# EAGLE design power_switch_1 (EAGLE 6.4)
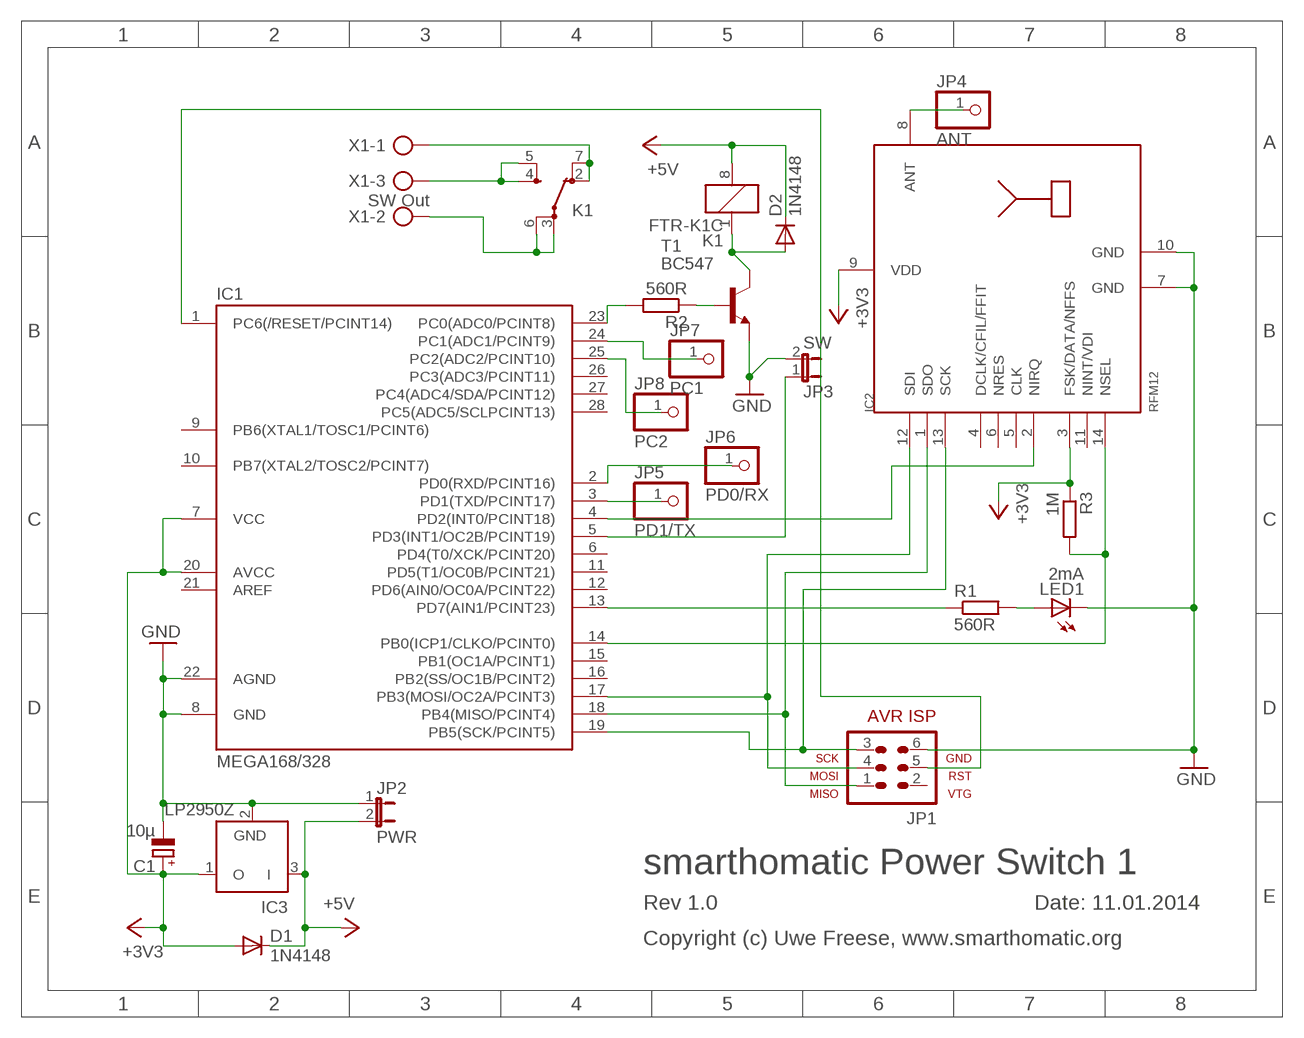
[diagram p0: schematic, sheet 1]

## Parts
C1  10µ  CPOL-EUE1.8-4  [E1,8-4]
D1  1N4148  1N4148DO35-7  [DO35-7]
D2  1N4148  1N4148DO35-7  [DO35-7]
IC1  MEGA168/328  MEGA48/88/168-PU  [DIL28-3]
IC2  RFM12  [RFM]
IC3  LP2950Z  [TO92]
JP1  AVR-ISP-6  [AVR-ISP-6]
JP2  PWR  JP1E  [JP1]
JP3  SW  JP1E  [JP1]
JP4  ANT  PINHD-1X1  [1X01]
JP5  PD1/TX  PINHD-1X1  [1X01]
JP6  PD0/RX  PINHD-1X1  [1X01]
JP7  PC1  PINHD-1X1  [1X01]
JP8  PC2  PINHD-1X1  [1X01]
K1  FTR-K1C  [FTR-K1C]
LED1  2mA  LED3MM  [LED3MM]
R1  560R  R-EU_0207/7  [0207/7]
R2  560R  R-EU_0207/7  [0207/7]
R3  1M  R-EU_0207/7  [0207/7]
T1  BC547  [TO92]
X1  SW Out  AK500/3  [AK500/3]

## Nets
+3V3: C1.+ D1.A IC1.7(VCC) IC1.20(AVCC) IC2.3(FSK/DATA/NFFS) IC2.9(VDD) IC3.1(O) R3.1
+5V: D1.C D2.C IC3.3(I) JP2.2 K1.8
GND: C1.- IC1.8(GND) IC1.22(AGND) IC2.7(GND) IC2.10(GND) IC3.2(GND) JP1.6 JP2.1 JP3.2 LED1.K(C) T1.1(E)
N$1: IC1.23(PC0(ADC0/PCINT8)) R2.2
N$3: IC1.17(PB3(MOSI/OC2A/PCINT3)) IC2.12(SDI) JP1.4
N$4: IC1.18(PB4(MISO/PCINT4)) IC2.1(SDO) JP1.1
N$5: IC1.19(PB5(SCK/PCINT5)) IC2.13(SCK) JP1.3
N$6: IC1.13(PD7(AIN1/PCINT23)) R1.1
N$7: R2.1 T1.2(B)
N$8: IC1.1(PC6(/RESET/PCINT14)) JP1.5
N$9: D2.A K1.1 T1.3(C)
N$10: IC1.5(PD3(INT1/OC2B/PCINT19)) JP3.1
N$11: IC2.8(ANT) JP4.1
N$12: LED1.A R1.2
N$13: IC1.14(PB0(ICP1/CLKO/PCINT0)) IC2.14(NSEL) R3.2
N$14: K1.2(-1:OA) K1.7(-1:OB) X1.1
N$15: IC1.4(PD2(INT0/PCINT18)) IC2.2(NIRQ)
N$16: IC1.24(PC1(ADC1/PCINT9)) JP7.1
N$17: IC1.25(PC2(ADC2/PCINT10)) JP8.1
N$18: K1.4(-1:SA) K1.5(-1:SB) X1.3
N$19: IC1.2(PD0(RXD/PCINT16)) JP6.1
N$20: IC1.3(PD1(TXD/PCINT17)) JP5.1
N$21: K1.3(-1:PA) K1.6(-1:PB) X1.2
Unconnected: IC1.6(PD4(T0/XCK/PCINT20)) IC1.9(PB6(XTAL1/TOSC1/PCINT6)) IC1.10(PB7(XTAL2/TOSC2/PCINT7)) IC1.11(PD5(T1/OC0B/PCINT21)) IC1.12(PD6(AIN0/OC0A/PCINT22)) IC1.15(PB1(OC1A/PCINT1)) IC1.16(PB2(SS/OC1B/PCINT2)) IC1.21(AREF) IC1.26(PC3(ADC3/PCINT11)) IC1.27(PC4(ADC4/SDA/PCINT12)) IC1.28(PC5(ADC5/SCLPCINT13)) IC2.4(DCLK/CFIL/FFIT) IC2.5(CLK) IC2.6(NRES) IC2.11(NINT/VDI) JP1.2

## Notes on the sheet
- smarthomatic Power Switch 1
- Rev 1.0 | Date: 11.01.2014
- Copyright (c) Uwe Freese, www.smarthomatic.org

## Library data of the parts
C1 = rcl:CPOL-EU: POLARIZED CAPACITOR, European symbol
D1 D2 = diode:1N4148: DIODE high speed (Philips)
IC1 = avr-5-4.16:MEGA48/88/168-PU
IC2 = hopeRF:RFM12
IC3 = linear:LP2950: 100 mA, Low Power Low Dropout Voltage Regulator Source: http://www.onsemi.com/pub/Collateral/LP2950-D.PDF
JP1 = avr-5-4.16:AVR-ISP-6: AVR ISP-6 Serial Programming Header
JP2 JP3 = jumper:JP1E: JUMPER
JP4-JP8 = pinhead:PINHD-1X1: PIN HEADER
K1 = relay:FTR-K1C: NETZRELAIS FTR-K1CK024W1XUM 16A/250VAC 1 Umschaltkontakt Distributor: Conrad Electronic Bestell Nr.: 504389-13 - 24V Source: http://www.produktinfo.conrad.com/datenblaetter/500000-524999/504384-da-01-de-NETZRELAIS_FTR_K1CK012W1XUM_16A_250VAC.pdf; OC_FARNELL: unknown; OC_NEWARK: unknown
LED1 = led:LED: LED OSRAM: - CHIPLED LG R971, LG N971, LY N971, LG Q971, LY Q971, LO R971, LY R971 LH N974, LH R974 LS Q976, LO Q976, LY Q976 LO Q996 - Hyper CHIPLED LW Q18S LB Q993, LB Q99A, LB R99A - SideLED LS A670, LO A670, LY A670, LG A670, LP A670 LB A673, LV A673, LT A673, LW A673 LH A674 LY A675 LS A676, LA A676, LO A676, LY A676, LW A676 LS A679, LY A679, LG A679 - Hyper Micro SIDELED® LS Y876, LA Y876, LO Y876, LY Y876 LT Y87S - SmartLED LW L88C, LW L88S LB L89C, LB L89S, LG L890 LS L89K, LO L89K, LY L89K LS L896, LA L896, LO L896, LY L896 - TOPLED LS T670, LO T670, LY T670, LG T670, LP T670 LSG T670, LSP T670, LSY T670, LOP T670, LYG T670 LG T671, LOG T671, LSG T671 LB T673, LV T673, LT T673, LW T673 LH T674 LS T676, LA T676, LO T676, LY T676, LB T676, LH T676, LSB T676, LW T676 LB T67C, LV T67C, LT T67C, LS T67K, LO T67K, LY T67K, LW E67C LS E67B, LA E67B, LO E67B, LY E67B, LB E67C, LV E67C, LT E67C LW T67C LS T679, LY T679, LG T679 LS T770, LO T770, LY T770, LG T770, LP T770 LB T773, LV T773, LT T773, LW T773 LH T774 LS E675, LA E675, LY E675, LS T675 LS T776, LA T776, LO T776, LY T776, LB T776 LHGB T686 LT T68C, LB T68C - Hyper Mini TOPLED® LB M676 - Mini TOPLED Santana® LG M470 LS M47K, LO M47K, LY M47K Source: http://www.osram.convergy.de LUXEON: - LUMILED® LXK2-PW12-R00, LXK2-PW12-S00, LXK2-PW14-U00, LXK2-PW14-V00 LXK2-PM12-R00, LXK2-PM12-S00, LXK2-PM14-U00 LXK2-PE12-Q00, LXK2-PE12-R00, LXK2-PE12-S00, LXK2-PE14-T00, LXK2-PE14-U00 LXK2-PB12-K00, LXK2-PB12-L00, LXK2-PB12-M00, LXK2-PB14-N00, LXK2-PB14-P00, LXK2-PB14-Q00 LXK2-PR12-L00, LXK2-PR12-M00, LXK2-PR14-Q00, LXK2-PR14-R00 LXK2-PD12-Q00, LXK2-PD12-R00, LXK2-PD12-S00 LXK2-PH12-R00, LXK2-PH12-S00 LXK2-PL12-P00, LXK2-PL12-Q00, LXK2-PL12-R00 Source: www.luxeon.com KINGBRIGHT: KA-3528ASYC Source: www.kingbright.com
R1-R3 = rcl:R-EU_: RESISTOR, European symbol
T1 = transistor:BC547: NPN TRANSISTOR
X1 = con-ptr500:AK500/3: CONNECTOR; OC_FARNELL: unknown; OC_NEWARK: unknown

## Net classes
0 default: clearance 0.305 mm

## Board
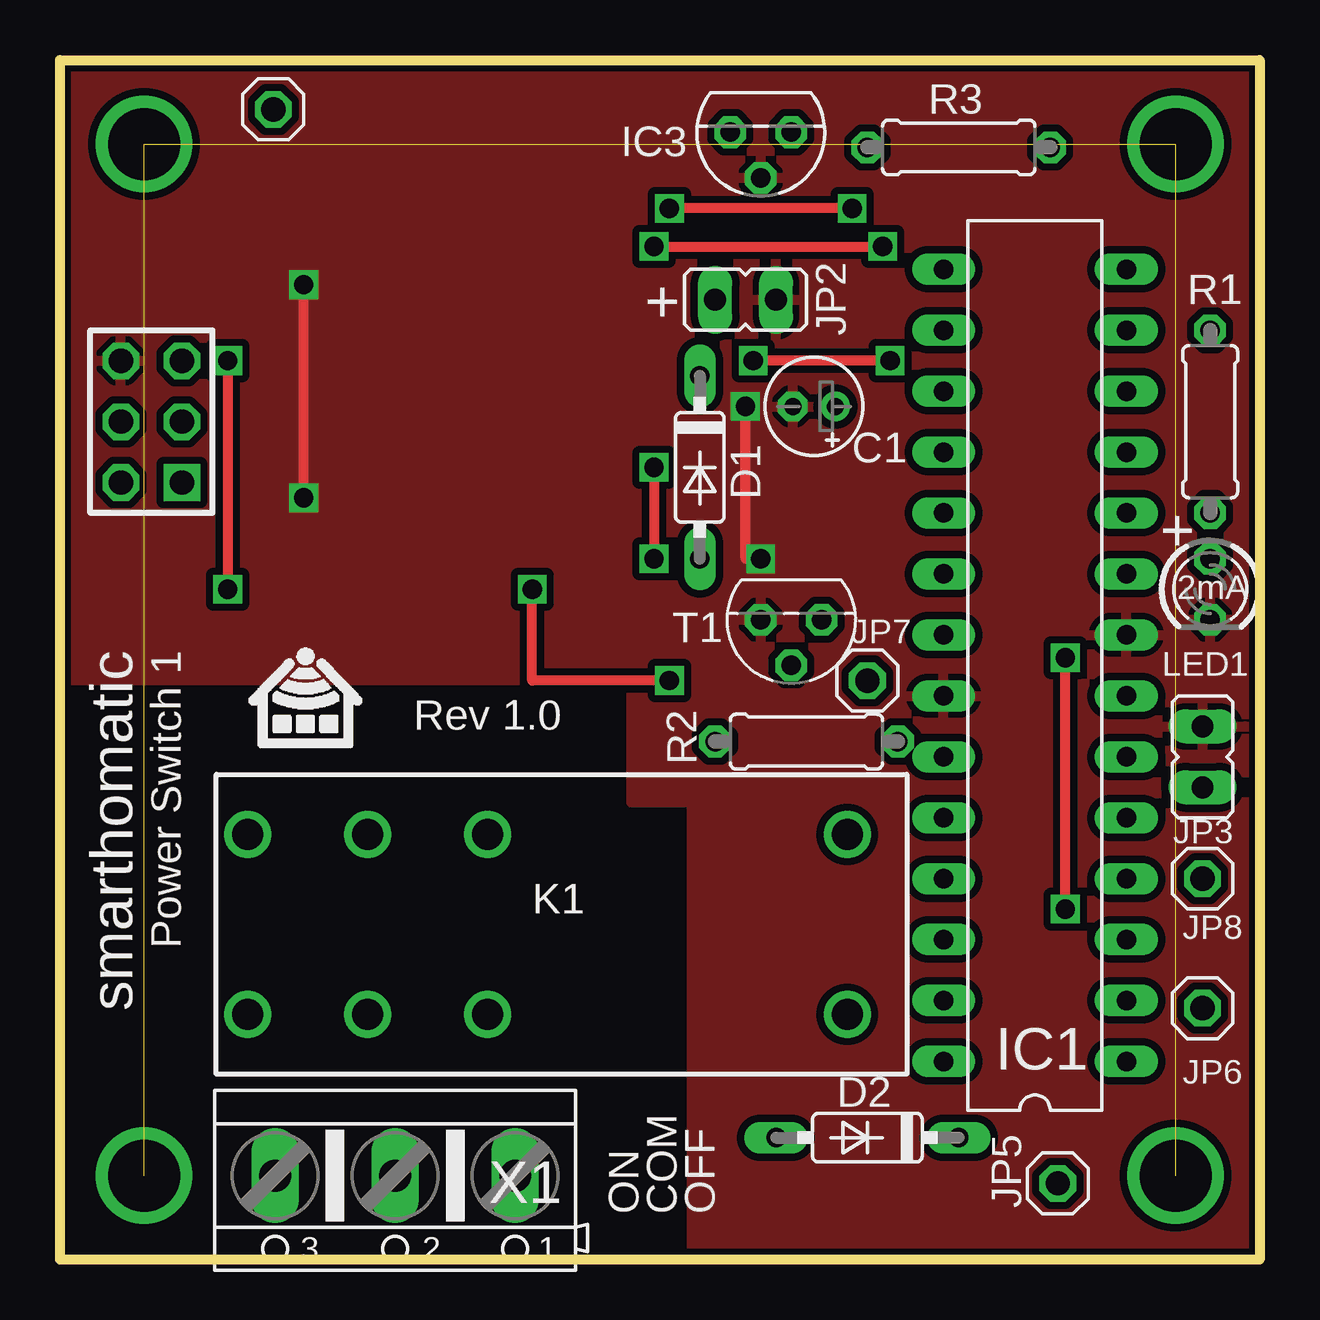
[diagram p1: board, top side]
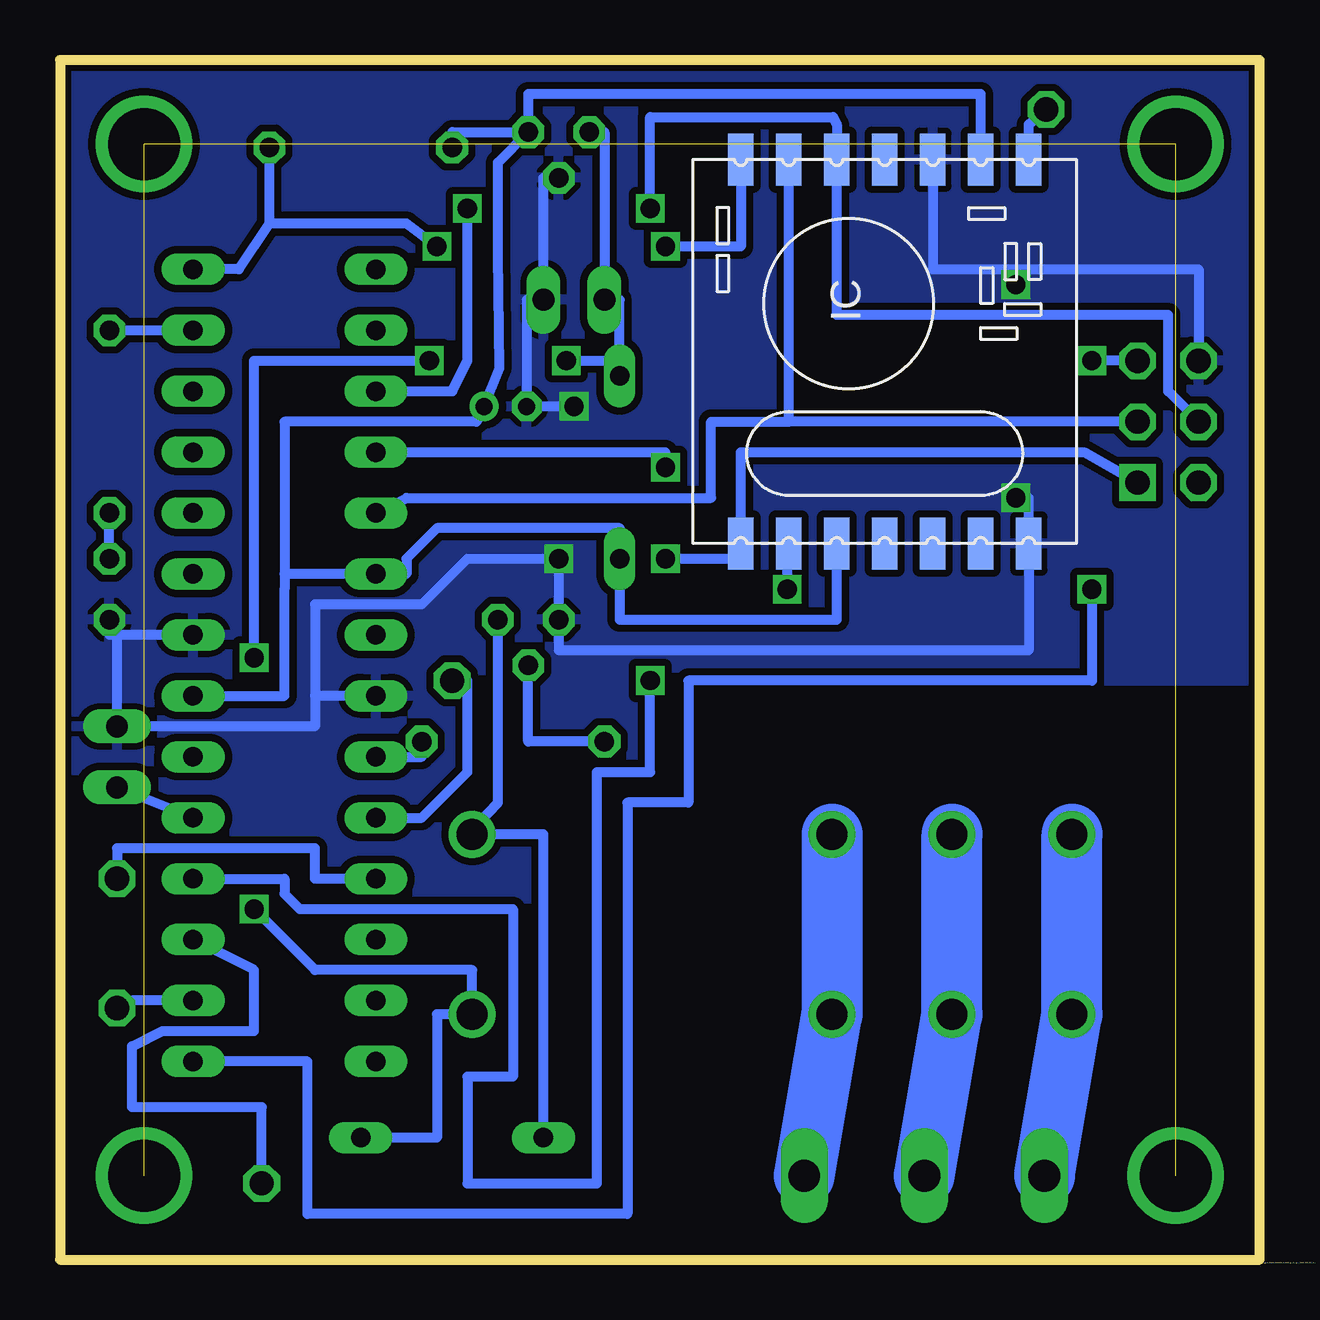
[diagram p2: board, bottom side, seen from below]

Size 50 x 50 mm. Coordinates in mm from the lower left corner, seen from the top.
Outline: 0,0 0,50 50,50 50,0 0,0
Copper layers (1*16): Top 0.035mm / dielectric 1.5mm / Bottom 0.035mm
Design rules "Fusion_eagle_rule_v1.1": minimum track width 6mil, minimum drill 12mil, track to track 6mil, track to pad 6mil, pad to pad 6mil, via to via 6mil, smd to smd 0mil, copper to edge 10mil, drill to drill 10mil, minimum pad ring 10mil, minimum via ring 6mil, stop-mask expansion 2mil, vias tented up to drill 100mil, thermal gap 10mil

### Footprints (pad centres in the part's own frame; a part is rotated, then mirrored left to right if it is on the bottom)
E1,8-4 = drill 0.711 pad 1.168: + -0.889,0 | drill 0.711 pad 1.168 octagon: - 0.889,0
DO35-7 = drill 0.813 long: A 3.81,0; C -3.81,0
DIL28-3 = drill 0.813 long: 1 -16.51,-3.81; 2 -13.97,-3.81; 3 -11.43,-3.81; 4 -8.89,-3.81; 5 -6.35,-3.81; 6 -3.81,-3.81; 7 -1.27,-3.81; 8 1.27,-3.81; 9 3.81,-3.81; 10 6.35,-3.81; 11 8.89,-3.81; 12 11.43,-3.81; 13 13.97,-3.81; 14 16.51,-3.81; 15 16.51,3.81; 16 13.97,3.81; 17 11.43,3.81; 18 8.89,3.81; 19 6.35,3.81; 20 3.81,3.81; 21 1.27,3.81; 22 -1.27,3.81; 23 -3.81,3.81; 24 -6.35,3.81; 25 -8.89,3.81; 26 -11.43,3.81; 27 -13.97,3.81; 28 -16.51,3.81
RFM = smd 2.184 x 1.067: 1 0,14; 2 0,12; 3 0,10; 4 0,8; 5 0,6; 6 0,4; 7 0,2; 8 16,2; 9 16,4; 10 16,6; 11 16,8; 12 16,10; 13 16,12; 14 16,14
TO92 = drill 0.813 octagon: 1 -1.27,0; 2 0,1.905; 3 1.27,0
AVR-ISP-6 = drill 1.016 square: 1 -2.54,-1.27 | drill 1.016 octagon: 2 -2.54,1.27; 3 0,-1.27; 4 0,1.27; 5 2.54,-1.27; 6 2.54,1.27
JP1 = drill 0.914 long: 1 0,-1.27; 2 0,1.27
1X01 = drill 1.016 octagon: 1 0,0
FTR-K1C = drill 1.3 pad 1.93: 1 -12.5,-3.75; 2 2.5,-3.75; 3 7.5,-3.75; 4 12.5,-3.75; 5 12.5,3.75; 6 7.5,3.75; 7 2.5,3.75; 8 -12.5,3.75
LED3MM = drill 0.813 octagon: A -1.27,0; K 1.27,0
0207/7 = drill 0.813 octagon: 1 -3.81,0; 2 3.81,0
TO92' = drill 0.813 octagon: 1 1.27,0; 2 0,1.905; 3 -1.27,0
AK500/3 = drill 1.321 long: 1 -5.004,0; 2 0,0; 3 5.004,0

### Placement (x,y rotation side)
C1  31.43,35.56 180 top
D1  26.67,33.02 270 top
D2  33.66,5.08 180 top
IC1  40.64,24.77 90 top
IC2  7.62,29.84 90 bottom
IC3  29.21,46.99 180 top
JP1  3.81,34.92 90 top
JP2  28.57,40.01 90 top
JP3  47.62,20.95 0 top
JP4  8.89,47.94 90 top
JP5  41.59,3.17 90 top
JP6  47.62,10.48 0 top
JP7  33.66,24.13 0 top
JP8  47.62,15.88 0 top
K1  20.32,13.97 180 top
LED1  47.94,27.94 270 top
R1  47.94,34.92 270 top
R2  31.11,21.59 0 top
R3  37.47,46.35 0 top
T1  BC547  [TO92']  30.48,26.67 180 top
X1  13.97,3.49 180 top

### Tracks (layer width: path | path; a pad name or v marks a point on that pad's centre or on a via)
+3V3
  Bottom 0.406: IC3.1 31.75,45.72 31.75,41.91 31.69,37.15 C1.+ 32.64,34.92 40.64,34.92 40.64,28.57 | IC1.7 40.64,23.5 40.64,27.94 40.64,28.57 | 40.64,28.57 IC1.20 35.56,28.57 35.56,29.21 34.29,30.48 26.67,30.48 D1.A 26.67,26.67 17.78,26.67 17.62,26.67 IC2.3 | R3.1 33.66,46.99 IC3.1 | IC2.9 11.62,48.58 30.48,48.58 IC3.1
+5V  (via drill 0.8)
  Top 0.406: v41.91,14.61 v41.91,25.08 | v34.61,37.47 v28.89,37.47
  Bottom 0.406: 26.67,37.47 26.67,40.01 JP2.2 27.3,46.99 IC3.3 | D2.C 34.29,5.08 34.29,10.22 K1.8 32.82,12.06 39.37,12.06 v41.91,14.61 | v41.91,25.08 41.91,37.47 v34.61,37.47 | v28.89,37.47 26.67,37.47 | 26.67,37.47 D1.C
GND  (via drill 0.8)
  Top 0.406: v29.21,29.21 28.57,29.21 v28.57,35.56 | v10.16,31.75 v10.16,40.64
  Bottom 0.406: IC2.10 13.62,41.27 10.16,41.27 | 10.16,41.27 2.54,41.27 JP1.6 | IC1.8 47.62,26.04 | 47.62,26.04 47.94,26.04 LED1.K | IC1.22 39.37,23.5 | 39.37,23.5 39.37,22.23 JP3.2 47.62,26.04 | v28.57,35.56 C1.- | 30.16,35.56 C1.- | IC3.2 29.84,45.09 JP2.1 30.54,40.01 C1.- | v10.16,31.75 9.62,31.75 IC2.7 9.62,25.4 29.21,25.4 T1.1 v29.21,29.21 33.02,29.21 34.92,27.3 39.37,27.3 39.37,23.5 | v10.16,40.64 10.16,41.27
  pour Bottom: 0,50.16 50.16,50.16 50.16,-0.32 26.35,-0.32 26.35,19.05 23.81,19.05 23.81,24.13 0,24.13
  pour Top: 0,50.16 50.16,50.16 50.16,-0.32 26.35,-0.32 26.35,19.05 23.81,19.05 23.81,24.13 0,24.13
N$1
  Bottom 0.406: IC1.23 34.92,20.95 R2.2
N$2  (via drill 3)  (3 unrouted)
  other vias: 3.5,46.5 46.5,46.5 46.5,3.5 3.5,3.5
N$3  (via drill 0.8)
  Top 0.406: v33.02,43.81 v25.4,43.81
  Bottom 0.406: JP1.4 3.81,36.2 3.81,39.37 17.62,39.37 IC2.12 17.62,47.31 17.78,47.62 25.4,47.62 v25.4,43.81 | IC1.17 33.66,36.2 33.02,37.47 v33.02,43.81
N$4  (via drill 0.8)
  Top 0.406: v24.77,33.02 v24.77,29.21
  Bottom 0.406: JP1.1 7.3,33.66 21.62,33.66 IC2.1 21.62,29.21 v24.77,29.21 | IC1.18 24.77,33.66 v24.77,33.02
N$5
  Bottom 0.406: JP1.3 19.62,34.92 | 19.62,34.92 IC2.13 | IC1.19 35.56,31.75 22.86,31.75 22.86,34.92 19.62,34.92
N$6
  Bottom 0.406: R1.1 IC1.13
N$7
  Bottom 0.406: R2.1 30.48,21.59 T1.2
N$8  (via drill 0.8)
  Top 0.406: v6.99,37.47 v6.99,27.94
  Bottom 0.406: IC1.1 39.69,8.26 39.69,1.91 26.35,1.91 26.35,19.05 23.81,19.05 23.81,24.13 6.99,24.13 v6.99,27.94 | JP1.5 v6.99,37.47
N$9
  Bottom 0.406: D2.A 29.84,16.51 29.84,17.72 K1.1 33.02,17.72 31.75,19.05 31.75,24.13 T1.3
N$10
  Bottom 0.406: IC1.5 JP3.1
N$11
  Bottom 0.406: IC2.8 9.62,47.31 JP4.1
N$12
  Bottom 0.406: LED1.A R1.2
N$13  (via drill 0.8)
  Top 0.406: v24.77,42.23 v34.29,42.23
  Bottom 0.406: R3.2 41.27,43.18 | 41.27,43.18 42.55,41.27 IC1.14 | IC2.14 21.62,42.23 v24.77,42.23 | v34.29,42.23 35.56,43.18 41.27,43.18
N$14
  Bottom 2.54: K1.2 K1.7 X1.1
N$15  (via drill 0.8)
  Top 0.406: v25.4,24.13 19.68,24.13 v19.68,27.94
  Bottom 0.406: IC1.4 40.64,15.88 40.64,15.24 40.01,14.61 31.11,14.61 31.11,7.62 33.02,7.62 33.02,3.17 27.62,3.17 27.62,20.32 25.4,20.32 v25.4,24.13 | v19.68,27.94 19.68,29.78 IC2.2
N$16
  Bottom 0.406: IC1.24 34.92,18.41 33.66,19.68 33.02,20.32 33.02,24.13 JP7.1
N$17
  Bottom 0.406: IC1.25 39.37,15.88 39.37,17.14 47.62,17.14 JP8.1
N$18
  Bottom 2.54: K1.4 K1.5 X1.3
N$19
  Bottom 0.406: IC1.2 46.99,10.79 JP6.1
N$20
  Bottom 0.406: JP5.1 41.59,6.35 46.99,6.35 46.99,8.89 45.72,9.53 41.91,9.53 41.91,12.06 IC1.3
N$21
  Bottom 2.54: K1.3 K1.6 X1.2

### Text on the board
tNames: + | + | 2mA | smarthomatic | Power Switch 1 | Rev 1.0 | ON | COM | OFF
bNames: D:/Eigene Dateien/smarthomatic/logo/logo_black 150x133.bmp